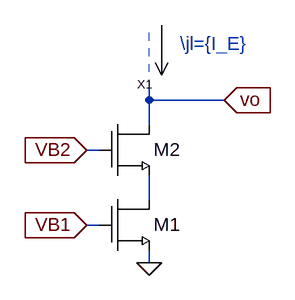
[diagram p0: schematic utf8.asc]
utf8.asc, the LTspice schematic file:
Version 4
SHEET 1 1120 680
WIRE 112 288 112 272
WIRE 208 288 112 288
WIRE 112 320 112 288
WIRE 48 352 32 352
WIRE 112 416 112 384
WIRE 48 448 32 448
WIRE 112 496 112 480
FLAG 112 496 0
FLAG 208 288 vo
IOPIN 208 288 In
FLAG 32 448 VB1
IOPIN 32 448 In
FLAG 32 352 VB2
IOPIN 32 352 In
SYMBOL svg/svg_nmos 48 400 R0
SYMATTR InstName M1
SYMBOL svg/svg_nmos 48 304 R0
SYMATTR InstName M2
SYMBOL svg_meas_I 160 256 R180
SYMATTR InstName X1
TEXT 152 216 Left 2 ;\\jl={I_E}
LINE Normal 112 272 112 192 1

The netlist it stands for:
* utf8.asc
M1 N001 VB1 0 0 nmodel W=1E7 L=1E8
M2 vo VB2 N001 N001 nmodel W=1E7 L=1E8
XX1 svg_meas_I
.model NMOS NMOS
.model PMOS PMOS
.lib standard.mos
* \jl={I_E}
.backanno
.end